# EAGLE design IMU (EAGLE 9.3.0)
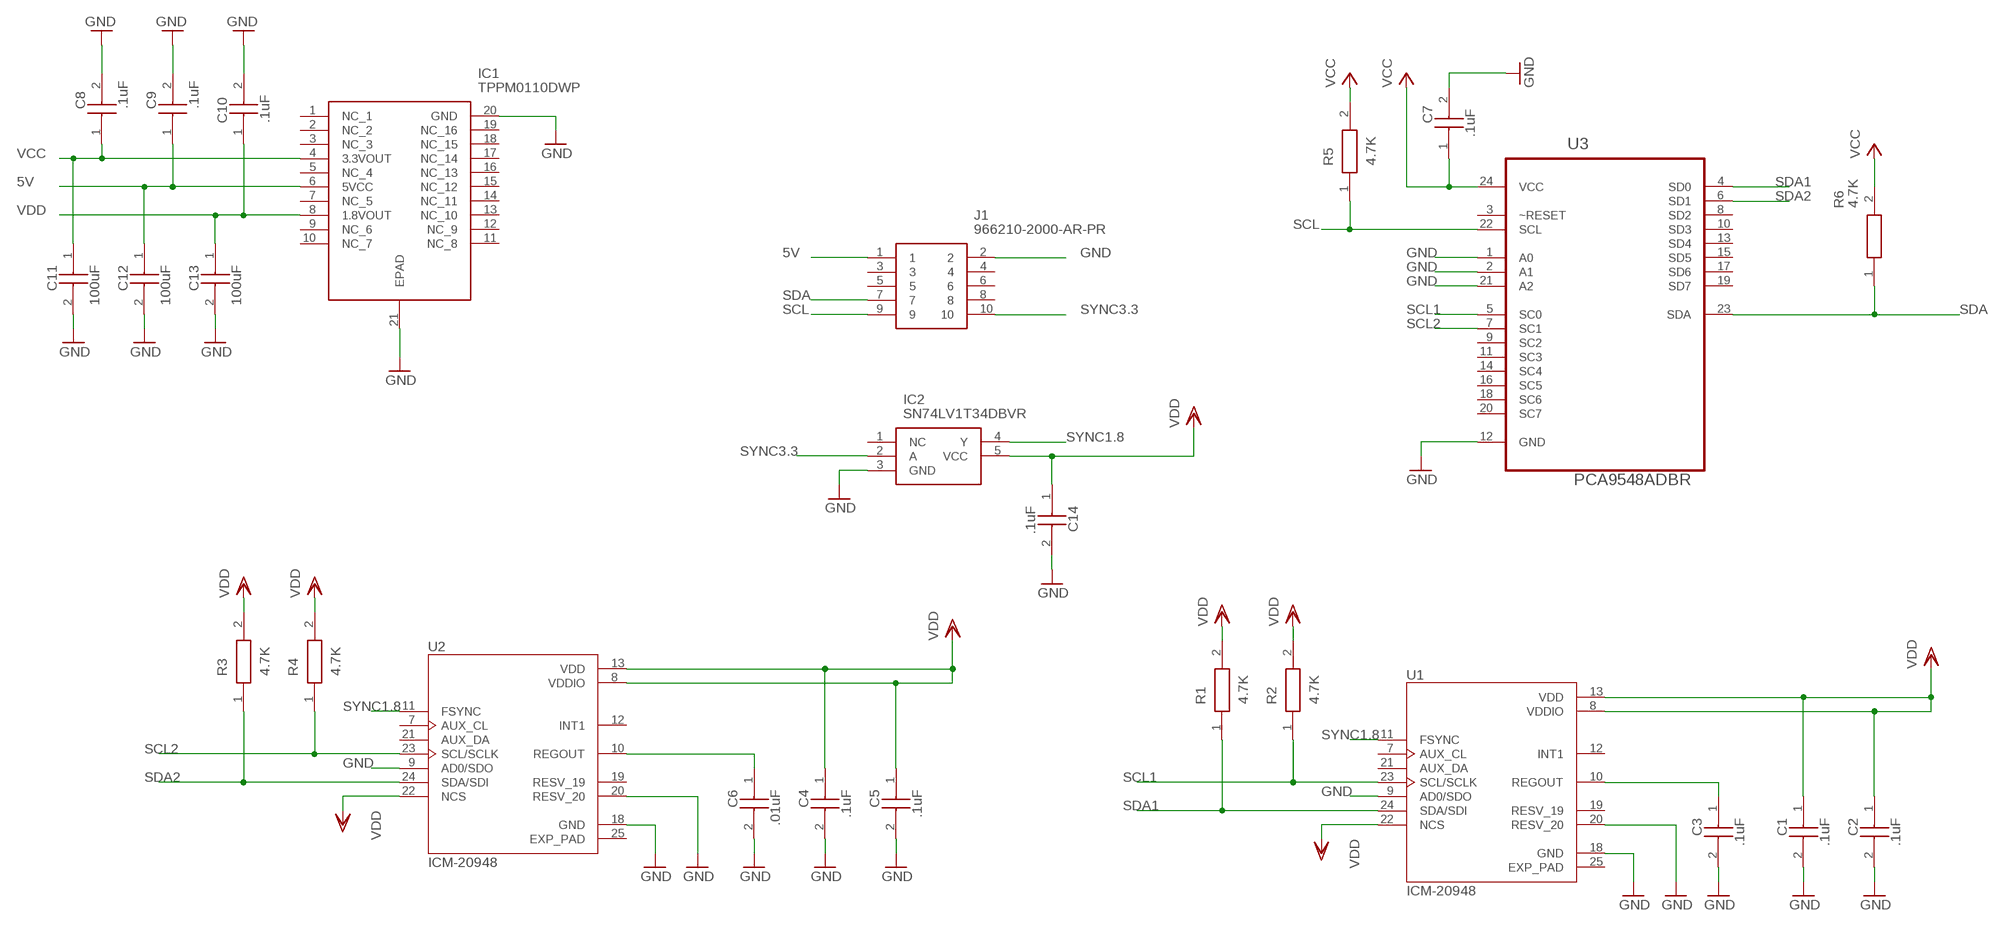
[diagram p0: schematic, sheet 1]

## Parts
C1  .1uF  C0805C104K6RACTU  [CAPC2012X88N]
C2  .1uF  C0805C104K6RACTU  [CAPC2012X88N]
C3  .1uF  C0805C104K6RACTU  [CAPC2012X88N]
C4  .1uF  C0805C104K6RACTU  [CAPC2012X88N]
C5  .1uF  C0805C104K6RACTU  [CAPC2012X88N]
C6  .01uF  C0805C104K6RACTU  [CAPC2012X88N]
C7  .1uF  C0805C104K6RACTU  [CAPC2012X88N]
C8  .1uF  C0805C104K6RACTU  [CAPC2012X88N]
C9  .1uF  C0805C104K6RACTU  [CAPC2012X88N]
C10  .1uF  C0805C104K6RACTU  [CAPC2012X88N]
C11  100uF  12106D107MAT2A  [CAPC3225X279N]
C12  100uF  12106D107MAT2A  [CAPC3225X279N]
C13  100uF  12106D107MAT2A  [CAPC3225X279N]
C14  .1uF  C0805C104K6RACTU  [CAPC2012X88N]
IC1  TPPM0110DWP  [SOIC127P1040X265-21N]
IC2  SN74LV1T34DBVR  [SOT95P280X145-5N]
J1  966210-2000-AR-PR  [966210-2000-AR-PR]
R1  4.7K  CRCW12064K70FKEBC  [RESC3216X60N]
R2  4.7K  CRCW12064K70FKEBC  [RESC3216X60N]
R3  4.7K  CRCW12064K70FKEBC  [RESC3216X60N]
R4  4.7K  CRCW12064K70FKEBC  [RESC3216X60N]
R5  4.7K  CRCW12064K70FKEBC  [RESC3216X60N]
R6  4.7K  CRCW12064K70FKEBC  [RESC3216X60N]
U1  ICM-20948  [QFN40P300X300X105-25N]
U2  ICM-20948  [QFN40P300X300X105-25N]
U3  PCA9548ADBR  [SOP65P780X200-24N]

## Nets
5V: C9.1 C12.1(C1) IC1.6(5VCC) J1.1
GND: C1.2 C2.2 C3.2 C4.2 C5.2 C6.2 C7.2 C8.2 C9.2 C10.2 C11.2(C2) C12.2(C2) C13.2(C2) C14.2 IC1.20(GND) IC1.21(EPAD) IC2.3(GND) J1.2 U1.9(AD0/SDO) U1.18(GND) U1.20(RESV_20) U2.9(AD0/SDO) U2.18(GND) U2.20(RESV_20) U3.1(A0) U3.2(A1) U3.12(GND) U3.21(A2)
N$1: C6.1 U2.10(REGOUT)
N$3: C3.1 U1.10(REGOUT)
SCL: J1.9 R5.1 U3.22(SCL)
SCL1: R2.1 U1.23(SCL/SCLK) U3.5(SC0)
SCL2: R4.1 U2.23(SCL/SCLK) U3.7(SC1)
SDA: J1.7 R6.1 U3.23(SDA)
SDA1: R1.1 U1.24(SDA/SDI) U3.4(SD0)
SDA2: R3.1 U2.24(SDA/SDI) U3.6(SD1)
SYNC1.8: IC2.4(Y) U1.11(FSYNC) U2.11(FSYNC)
SYNC3.3: IC2.2(A) J1.10
VCC: C7.1 C8.1 C11.1(C1) IC1.4(3.3VOUT) R5.2 R6.2 U3.24(VCC)
VDD: C1.1 C2.1 C4.1 C5.1 C10.1 C13.1(C1) C14.1 IC1.8(1.8VOUT) IC2.5(VCC) R1.2 R2.2 R3.2 R4.2 U1.8(VDDIO) U1.13(VDD) U1.22(NCS) U2.8(VDDIO) U2.13(VDD) U2.22(NCS)
Unconnected: IC1.1(NC_1) IC1.2(NC_2) IC1.3(NC_3) IC1.5(NC_4) IC1.7(NC_5) IC1.9(NC_6) IC1.10(NC_7) IC1.11(NC_8) IC1.12(NC_9) IC1.13(NC_10) IC1.14(NC_11) IC1.15(NC_12) IC1.16(NC_13) IC1.17(NC_14) IC1.18(NC_15) IC1.19(NC_16) IC2.1(NC) J1.3 J1.4 J1.5 J1.6 J1.8 U1.7(AUX_CL) U1.12(INT1) U1.19(RESV_19) U1.21(AUX_DA) U2.7(AUX_CL) U2.12(INT1) U2.19(RESV_19) U2.21(AUX_DA) U3.3(~RESET) U3.8(SD2) U3.9(SC2) U3.10(SD3) U3.11(SC3) U3.13(SD4) U3.14(SC4) U3.15(SD5) U3.16(SC5) U3.17(SD6) U3.18(SC6) U3.19(SD7) U3.20(SC7)

## Power pins joined to a net without a drawn wire
EXP_PAD: U1.25(EXP_PAD) U2.25(EXP_PAD)

## Library data of the parts
C1-C10 C14 = SamacSys_Parts:C0805C104K6RACTU: KEMET - C0805C104K6RACTU - CAP, MLCC, X7R, 0.1UF, 35V, 0805 Source: Datasheet <https://componentsearchengine.com/Datasheets/1/C0805C104K6RACTU.pdf>; DESCRIPTION: KEMET - C0805C104K6RACTU - CAP, MLCC, X7R, 0.1UF, 35V, 0805; HEIGHT: 0.88mm; MANUFACTURER_NAME: Kemet; MANUFACTURER_PART_NUMBER: C0805C104K6RACTU; MOUSER_PART_NUMBER: 80-C0805C104K6R
C11-C13 = SamacSys_Parts:12106D107MAT2A: Capacitor 1210 100UF 20% 6.3V Source: Datasheet <https://componentsearchengine.com/Datasheets/1/12106D107MAT2A.pdf>; DESCRIPTION: Capacitor 1210 100UF 20% 6.3V; HEIGHT: mm; MANUFACTURER_NAME: AVX; MANUFACTURER_PART_NUMBER: 12106D107MAT2A; MOUSER_PART_NUMBER: 581-12106D107MAT2A
IC1 = SamacSys_Parts:TPPM0110DWP: LDO Voltage Regulators Dual-Output 3.3V & 1.8V Source: Datasheet <http://www.ti.com/lit/ds/symlink/tppm0110.pdf>; DESCRIPTION: LDO Voltage Regulators Dual-Output 3.3V & 1.8V; HEIGHT: 2.65mm; MANUFACTURER_NAME: Texas Instruments; MANUFACTURER_PART_NUMBER: TPPM0110DWP; MOUSER_PART_NUMBER: 595-TPPM0110DWP
IC2 = SamacSys_Parts:SN74LV1T34DBVR: Single Power Supply BUFFER Logic Level Shifter (no enable) Source: Datasheet <http://www.ti.com/lit/gpn/sn74lv1t34>; DESCRIPTION: Single Power Supply BUFFER Logic Level Shifter (no enable); HEIGHT: 1.45mm; MANUFACTURER_NAME: Texas Instruments; MANUFACTURER_PART_NUMBER: SN74LV1T34DBVR; MOUSER_PART_NUMBER: 595-SN74LV1T34DBVR
J1 = SamacSys_Parts:966210-2000-AR-PR: Headers & Wire Housings 10P DUAL ENT DR SKT SMT LO PROFILE Source: Datasheet <https://componentsearchengine.com/Datasheets/1/966210-2000-AR-PR.pdf>; DESCRIPTION: Headers & Wire Housings 10P DUAL ENT DR SKT SMT LO PROFILE; HEIGHT: mm; MANUFACTURER_NAME: 3M; MANUFACTURER_PART_NUMBER: 966210-2000-AR-PR; MOUSER_PART_NUMBER: 517-9662102000ARPR
R1-R6 = SamacSys_Parts:CRCW12064K70FKEBC: Thick Film Resistors - SMD 1/4Watt 4.7Kohms 1% Commercial Use Source: Datasheet <https://componentsearchengine.com/Datasheets/1/CRCW12064K70FKEBC.pdf>; DESCRIPTION: Thick Film Resistors - SMD 1/4Watt 4.7Kohms 1% Commercial Use; HEIGHT: 0.6mm; MANUFACTURER_NAME: Vishay; MANUFACTURER_PART_NUMBER: CRCW12064K70FKEBC; MOUSER_PART_NUMBER: 71-CRCW12064K70FKEBC
U1 U2 = ICM-20948:ICM-20948: Axis=3 Axis Gyro+3 Axis Accel+Compass. Pin For Pin With m; DESCRIPTION: 9 Axis=3 Axis Gyro+3 Axis Accel+Compass. Pin For Pin With m; DIGI-KEY_PART_NUMBER: 1428-1123-1-ND; DIGI-KEY_PURCHASE_URL: https://www.digikey.com/product-detail/en/tdk-invensense/ICM-20948/1428-1123-1-ND/7062698?utm_source=snapeda&utm_medium=aggregator&utm_campaign=symbol; MF: TDK InvenSense; MP: ICM-20948; PACKAGE: QFN-24 InvenSense
U3 = PCA9548ADBR:PCA9548ADBR: 8-CHANNEL I2C SWITCH; AVAILABILITY: Unavailable; DESCRIPTION: 8-Channel I2C Switch With Reset 24-SSOP -40 to 85; MF: Texas Instruments; MP: PCA9548ADBR; PACKAGE: SSOP-24 Texas Instruments; PRICE: None

## Board
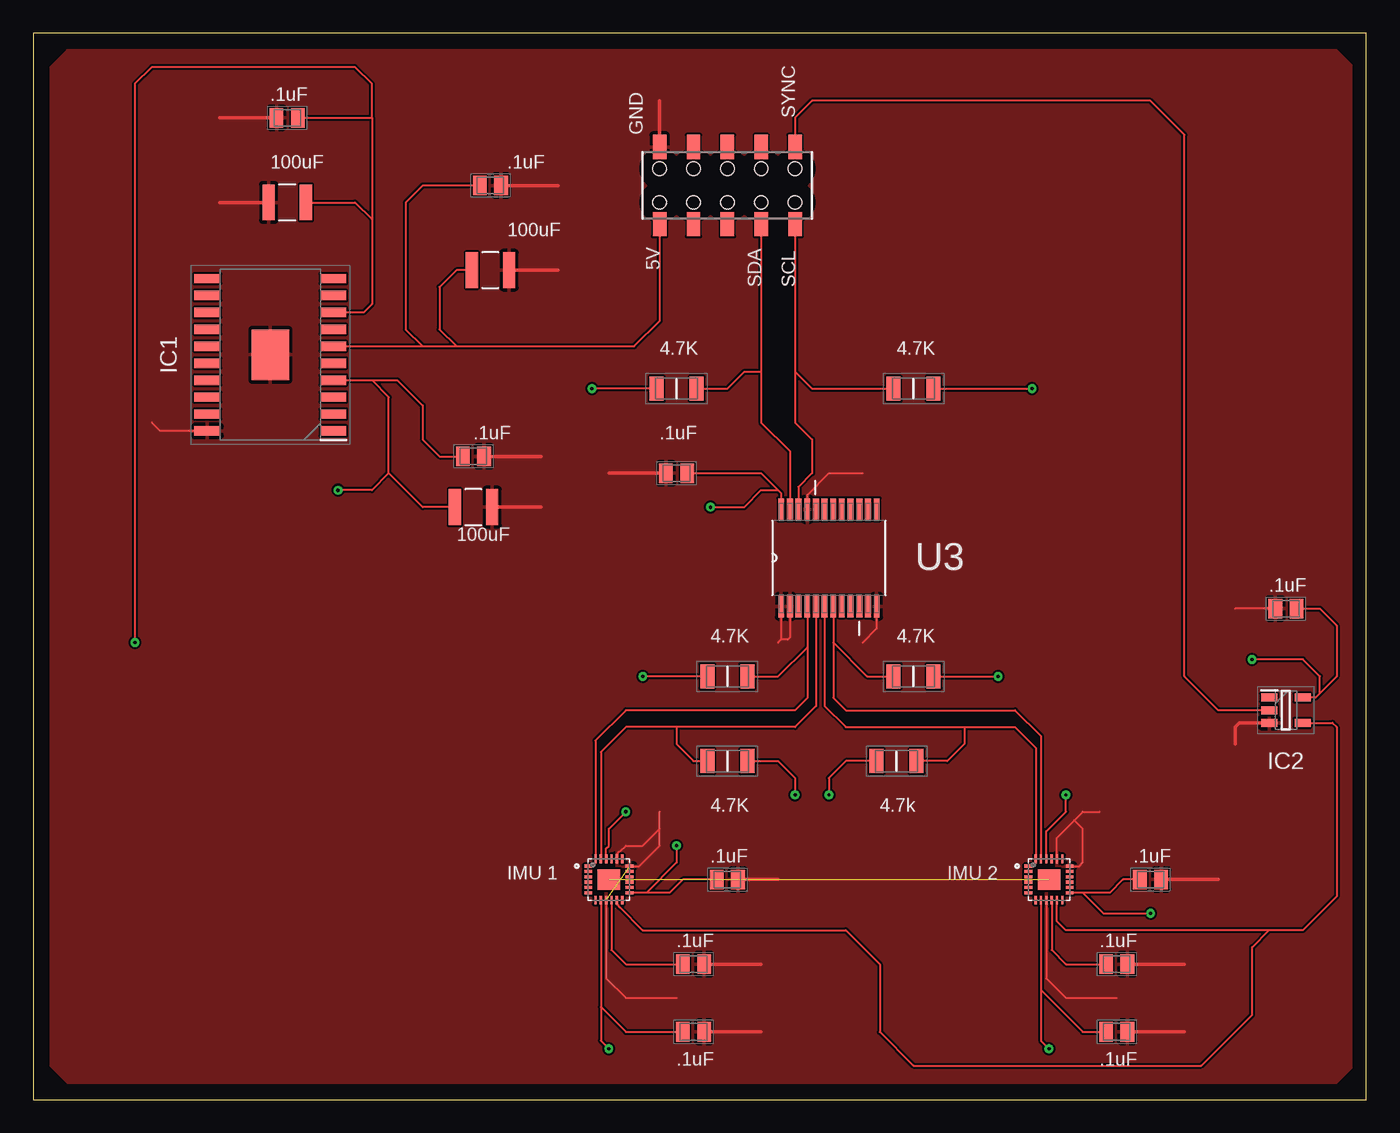
[diagram p1: board, top side]
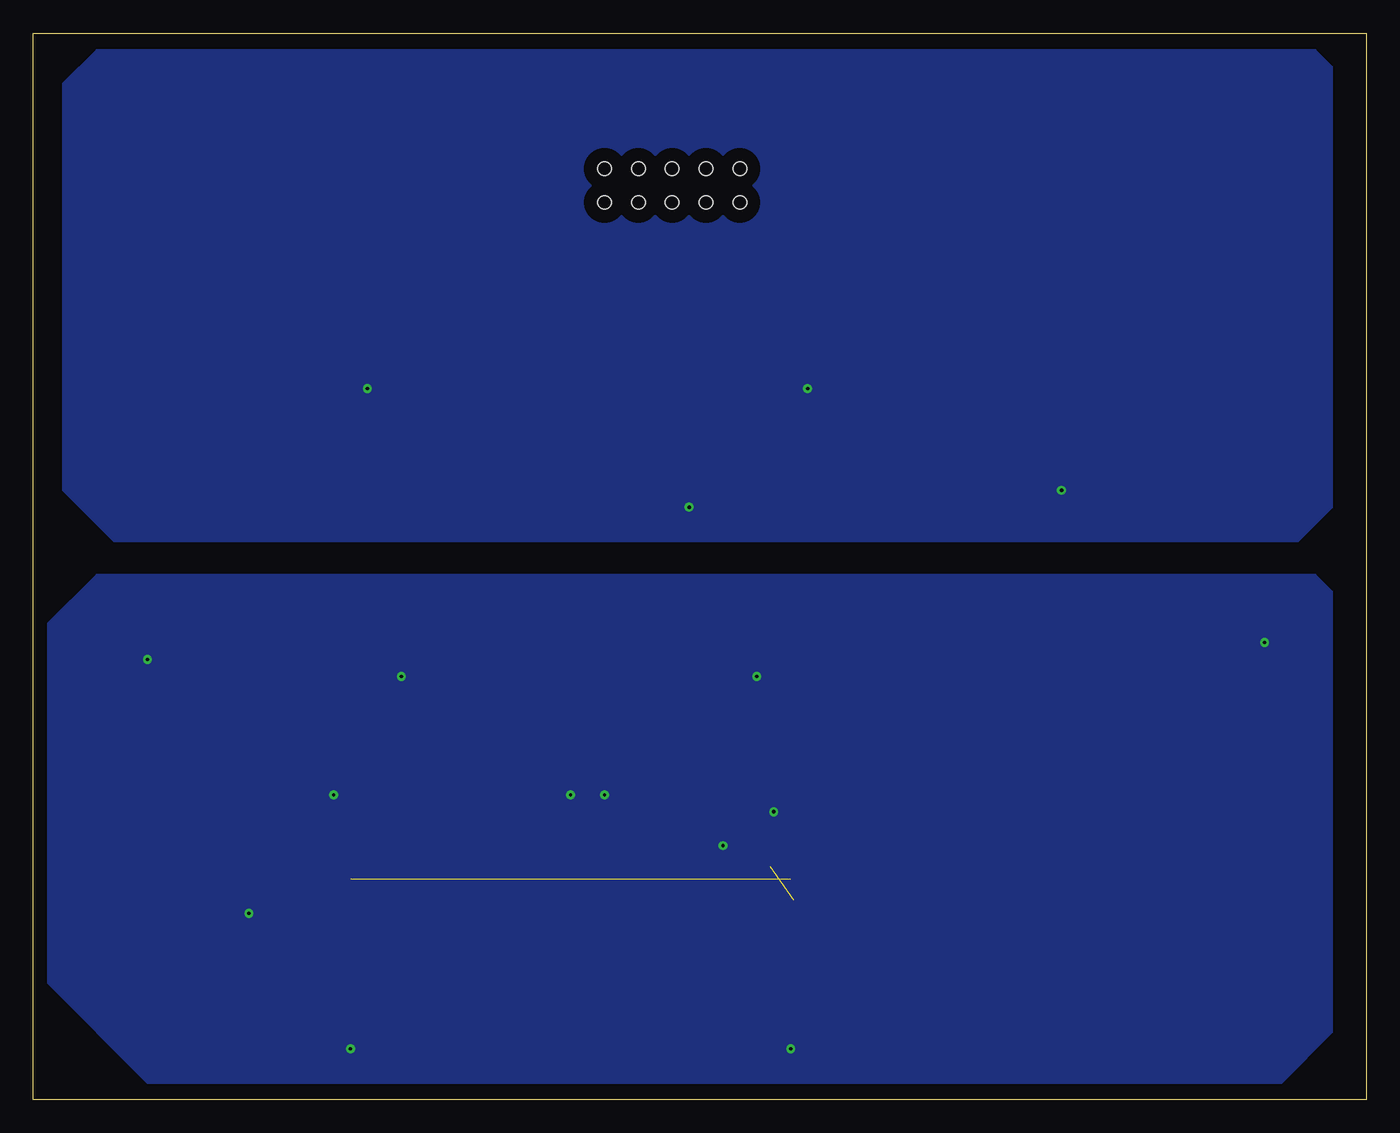
[diagram p2: board, bottom side, seen from below]

Size 100 x 80 mm. Coordinates in mm from the lower left corner, seen from the top.
Outline: 0,0 100,0 100,80 0,80 0,0
Copper layers (1*16): Top 0.035mm / dielectric 1.5mm / Bottom 0.035mm
Design rules "default *": minimum track width 6mil, minimum drill 0.35mm, track to track 6mil, track to pad 6mil, pad to pad 6mil, via to via 6mil, smd to smd 6mil, copper to edge 40mil, drill to drill 6mil, minimum pad ring 10mil, minimum via ring 8mil, stop-mask expansion 4mil, vias tented up to drill 0mil, thermal gap 10mil

### Footprints (pad centres in the part's own frame; a part is rotated, then mirrored left to right if it is on the bottom)
CAPC2012X88N = smd 1.02 x 1.47: 1 -0.8,0; 2 0.8,0
CAPC3225X279N = smd 0.914 x 2.692: 1 -1.397,0; 2 1.397,0
SOIC127P1040X265-21N = smd 1.94 x 0.7: 1 -4.73,5.715; 2 -4.73,4.445; 3 -4.73,3.175; 4 -4.73,1.905; 5 -4.73,0.635; 6 -4.73,-0.635; 7 -4.73,-1.905; 8 -4.73,-3.175; 9 -4.73,-4.445; 10 -4.73,-5.715; 11 4.73,-5.715; 12 4.73,-4.445; 13 4.73,-3.175; 14 4.73,-1.905; 15 4.73,-0.635; 16 4.73,0.635; 17 4.73,1.905; 18 4.73,3.175; 19 4.73,4.445; 20 4.73,5.715 | smd 2.79 x 3.81: 21 0,0
SOT95P280X145-5N = smd 1.2 x 0.6: 1 -1.25,0.95; 2 -1.25,0; 3 -1.25,-0.95; 4 1.25,-0.95; 5 1.25,0.95
966210-2000-AR-PR = smd 1 x 1.82: 1 -5.08,-2.89; 2 -5.08,2.89; 3 -2.54,-2.89; 4 -2.54,2.89; 5 0,-2.89; 6 0,2.89; 7 2.54,-2.89; 8 2.54,2.89; 9 5.08,-2.89; 10 5.08,2.89 | hole 1.02: -5.08,-1.27; -5.08,1.27; -2.54,-1.27; -2.54,1.27; 0,-1.27; 0,1.27; 2.54,-1.27; 2.54,1.27; 5.08,-1.27; 5.08,1.27
RESC3216X60N = smd 1.05 x 1.8: 1 -1.5,0; 2 1.5,0
QFN40P300X300X105-25N = smd 0.64 x 0.22: 1 -1.545,1; 2 -1.545,0.6; 3 -1.545,0.2; 4 -1.545,-0.2; 5 -1.545,-0.6; 6 -1.545,-1; 13 1.545,-1; 14 1.545,-0.6; 15 1.545,-0.2; 16 1.545,0.2; 17 1.545,0.6; 18 1.545,1 | smd 0.22 x 0.64: 7 -1,-1.545; 8 -0.6,-1.545; 9 -0.2,-1.545; 10 0.2,-1.545; 11 0.6,-1.545; 12 1,-1.545; 19 1,1.545; 20 0.6,1.545; 21 0.2,1.545; 22 -0.2,1.545; 23 -0.6,1.545; 24 -1,1.545 | smd 1.7 x 1.54: 25 0,0
SOP65P780X200-24N = smd 1.651 x 0.432: 1 -3.632,3.581; 2 -3.632,2.921; 3 -3.632,2.286; 4 -3.632,1.626; 5 -3.632,0.965; 6 -3.632,0.33; 7 -3.632,-0.33; 8 -3.632,-0.965; 9 -3.632,-1.626; 10 -3.632,-2.286; 11 -3.632,-2.921; 12 -3.632,-3.581; 13 3.632,-3.581; 14 3.632,-2.921; 15 3.632,-2.286; 16 3.632,-1.626; 17 3.632,-0.965; 18 3.632,-0.33; 19 3.632,0.33; 20 3.632,0.965; 21 3.632,1.626; 22 3.632,2.286; 23 3.632,2.921; 24 3.632,3.581

### Placement (x,y rotation side)
C1  52.07,16.51 0 top
C2  49.53,5.08 0 top
C3  49.53,10.16 0 top
C4  83.82,16.51 0 top
C5  81.28,5.08 0 top
C6  81.28,10.16 0 top
C7  48.26,46.99 180 top
C8  33.02,48.26 0 top
C9  34.29,68.58 0 top
C10  19.05,73.66 180 top
C11  33.02,44.45 0 top
C12  34.29,62.23 0 top
C13  19.05,67.31 180 top
C14  93.98,36.83 180 top
IC1  17.78,55.88 180 top
IC2  93.98,29.21 0 top
J1  52.07,68.58 0 top
R1  52.07,31.75 180 top
R2  52.07,25.4 0 top
R3  64.77,25.4 180 top
R4  66.04,31.75 0 top
R5  66.04,53.34 0 top
R6  48.26,53.34 180 top
U1  43.18,16.51 0 top
U2  76.2,16.51 0 top
U3  59.69,40.64 90 top

### Tracks (layer width: path | path; a pad name or v marks a point on that pad's centre or on a via)
5V
  Top 0.152: J1.1 46.99,58.42 45.09,56.52 31.75,56.52 | IC1.6 29.21,56.52 | 29.21,56.52 31.75,56.52 | C9.1 29.21,68.58 27.94,67.31 27.94,57.78 29.21,56.52 | C12.1 31.75,62.23 30.48,60.96 30.48,57.78 31.75,56.52
EXP_PAD  (1 unrouted)
GND  (1 unrouted)
  Top 0.152: U2.9 76,9.09 77.47,7.62 81.28,7.62 | U1.9 42.98,9.09 44.45,7.62 48.26,7.62 | C14.2 90.17,36.83 | IC1.20 9.53,50.16 8.89,50.8 | U3.21 58.06,45.36 59.69,46.99 62.23,46.99 | U3.1 56.11,34.52 | 56.11,34.52 55.88,34.29 | U3.2 56.77,34.67 56.62,34.52 56.11,34.52 | U3.12 63.27,35.33 62.23,34.29 | U1.20 43.78,18.39 43.99,18.6 44,18.6 44.45,19.05 45.72,19.05 46.99,20.32 | 46.99,20.32 46.99,21.59 | U1.18 45.45,17.51 46.99,19.05 46.99,20.32 | U2.20 76.8,19.65 78.11,20.95 | 78.11,20.95 78.74,21.59 80.01,21.59 | U2.18 78.47,17.51 78.74,17.78 78.74,20.32 78.11,20.95
  Top 0.254: C9.2 39.37,68.58 | J1.2 46.99,74.93 | C10.2 13.97,73.66 | C13.2 13.97,67.31 | C12.2 39.37,62.23 | C8.2 38.1,48.26 | C11.2 38.1,44.45 | C7.2 43.18,46.99 | C1.2 55.88,16.51 | 54.61,10.16 C3.2 | 54.61,5.08 C2.2 | 86.36,10.16 C6.2 | 86.36,5.08 C5.2 | C4.2 88.9,16.51 | IC2.3 90.49,28.26 90.17,27.94 90.17,26.67
  pour Top: 1.27,77.47 1.27,2.54 2.54,1.27 97.79,1.27 99.06,2.54 99.06,77.47 97.79,78.74 2.54,78.74
N$1
  Top 0.152: U2.10 76.4,11.23 77.47,10.16 C6.1
N$3
  Top 0.152: U1.10 43.38,11.23 44.45,10.16 C3.1
SCL
  Top 0.152: U3.22 57.4,45.97 58.42,46.99 58.42,49.53 57.15,50.8 57.15,54.61 | J1.9 57.15,54.61 | 57.15,54.61 58.42,53.34 R5.1
SCL1
  Top 0.152: U3.5 58.73,29.52 57.15,27.94 48.26,27.94 | 48.26,27.94 44.45,27.94 42.58,26.07 U1.23 | 48.26,27.94 48.26,26.67 49.53,25.4 R2.1
SCL2
  Top 0.152: U3.7 60.02,34.29 | 60.02,34.29 60.02,30.15 60.96,29.21 73.66,29.21 75.6,27.27 U2.23 | 60.02,34.29 62.56,31.75 R4.1
SDA
  Top 0.152: U3.23 56.77,48.64 54.61,50.8 54.61,54.61 | J1.7 54.61,54.61 | R6.1 52.07,53.34 53.34,54.61 54.61,54.61
SDA1
  Top 0.152: U3.4 58.06,33.93 | 58.06,33.93 58.06,30.12 57.15,29.21 44.45,29.21 42.18,26.94 U1.24 | R1.1 55.88,31.75 58.06,33.93
SDA2
  Top 0.152: U3.6 59.36,29.54 60.96,27.94 69.85,27.94 | 69.85,27.94 73.66,27.94 75.2,26.4 U2.24 | 69.85,27.94 69.85,26.67 68.58,25.4 R3.1
SYNC1.8
  Top 0.152: IC2.4 97.47,28.26 97.79,27.94 97.79,15.24 95.25,12.7 92.71,12.7 | 92.71,12.7 77.46,12.7 76.8,13.36 U2.11 | U1.11 43.78,14.63 43.99,14.42 44,14.42 45.72,12.7 60.96,12.7 63.5,10.16 63.5,5.08 66.04,2.54 87.63,2.54 91.44,6.35 91.44,11.43 92.71,12.7
SYNC3.3
  Top 0.152: IC2.2 88.9,29.21 86.36,31.75 86.36,72.39 83.82,74.93 58.42,74.93 57.15,73.66 J1.10
VCC  (via drill 0.25)
  Top 0.152: IC1.4 25.4,53.98 | 25.4,53.98 27.3,53.98 29.21,52.07 29.21,49.53 30.48,48.26 C8.1 | C11.1 29.21,44.45 26.67,46.99 | 25.4,53.98 26.67,52.7 26.67,46.99 | C7.1 54.61,46.99 55.88,45.72 | 55.88,45.72 56.11,45.49 U3.24 | 26.67,46.99 25.4,45.72 v22.86,45.72 | R6.2 v41.91,53.34 | R5.2 v74.93,53.34 | v50.8,44.45 53.34,44.45 54.61,45.72 55.88,45.72
  pour Bottom: 3.81,78.74 95.25,78.74 97.79,76.2 97.79,45.72 93.98,41.91 5.08,41.91 2.54,44.45 2.54,77.47
VDD  (via drill 0.25)
  Top 0.152: C1.1 48.73,16.51 47.73,15.51 45.99,15.51 | 45.99,15.51 U1.13 | U1.8 42.58,6.95 | 42.58,6.95 44.45,5.08 C2.1 | C4.1 81.75,16.51 80.75,15.51 78.74,15.51 | 78.74,15.51 U2.13 | 75.6,8.22 78.74,5.08 C5.1 | C13.1 24.13,67.31 25.4,66.04 | IC1.8 24.77,59.05 25.4,59.69 25.4,66.04 | C10.1 25.4,73.66 | 25.4,73.66 25.4,66.04 | C14.1 96.52,36.83 97.79,35.56 97.79,31.75 96.52,30.48 | 96.52,30.48 96.2,30.16 IC2.5 | U2.8 75.6,8.22 | 25.4,73.66 25.4,76.2 24.13,77.47 8.89,77.47 7.62,76.2 v7.62,34.29 | R1.2 v45.72,31.75 | R2.2 55.88,25.4 57.15,24.13 v57.15,22.86 | R3.2 60.96,25.4 59.69,24.13 v59.69,22.86 | v48.26,19.05 48.26,17.78 45.99,15.51 | U1.22 42.98,18.85 43.18,19.05 43.18,20.32 v44.45,21.59 | U2.22 76,20.12 77.47,21.59 v77.47,22.86 | 75.6,8.22 75.6,4.41 v76.2,3.81 | 42.58,6.95 42.58,4.41 v43.18,3.81 | 78.74,15.51 80.28,13.97 v83.82,13.97 | 96.52,30.48 96.52,31.75 95.25,33.02 v91.44,33.02 | R4.2 v72.39,31.75
  pour Bottom: 3.81,39.37 95.25,39.37 99.06,35.56 99.06,8.89 91.44,1.27 6.35,1.27 2.54,5.08 2.54,38.1

### Text on the board
tPlace: .1uF | SYNC | GND | 100uF | .1uF | 100uF | 5V | SDA | SCL | 4.7K | 4.7K | .1uF | .1uF | 100uF | .1uF | 4.7K | 4.7K | 4.7K | 4.7k | .1uF | .1uF | IMU 1 | IMU 2 | .1uF | .1uF | .1uF | .1uF